# Altium schematic sheet FULL_CB_Power_REV_C.SchDoc
size A4; DrawnBy: Philip Rowse
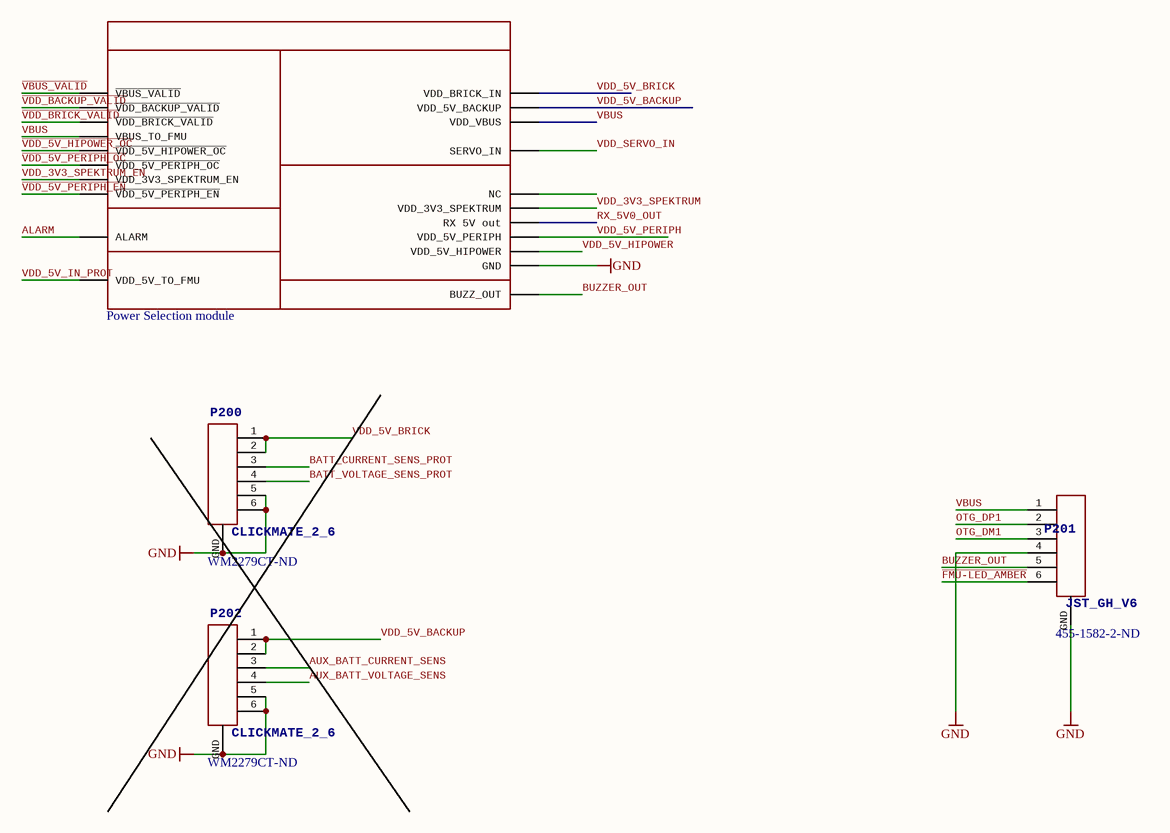
[diagram p0: FULL_CB_Power_REV_C.SchDoc]

## Parts
P200  CLICKMATE_2_6  Supplier Part Number 1: WM2279CT-ND  [CLICKMATE_V6_2MM]
P201  JST_GH_V6  Supplier Part Number 1: 455-1582-2-ND  [JST_GH_V6]
P202  CLICKMATE_2_6  Supplier Part Number 1: WM2279CT-ND  [CLICKMATE_V6_2MM]
PSM200  Power Selection module  [PSM]

## Nets
GND: P200.5 P200.6 P200.GND P201.4 P201.GND P202.5 P202.6 P202.GND PSM200.GND
ALARM: PSM200.ALARM
AUX_BATT_CURRENT_SENS: P202.3
AUX_BATT_VOLTAGE_SENS: P202.4
BATT_CURRENT_SENS_PROT: P200.3
BATT_VOLTAGE_SENS_PROT: P200.4
BUZZER_OUT: P201.5 PSM200.BUZZER_OUT(BUZZ_OUT)
~{FMU-LED_AMBER}: P201.6
OTG_DM1: P201.3
OTG_DP1: P201.2
RX_5V0_OUT: PSM200.RX(RX_5V_out)
~{VBUS_VALID}: PSM200.!VBUS_VALID(~{VBUS_VALID})
~{VDD_5V_HIPOWER_OC}: PSM200.!VDD_5V_HIPOWER_OC(~{VDD_5V_HIPOWER_OC})
~{VDD_5V_PERIPH_EN}: PSM200.!VDD_5V_PERIPH_EN(~{VDD_5V_PERIPH_EN})
~{VDD_5V_PERIPH_OC}: PSM200.!VDD_5V_PERIPH_OC(~{VDD_5V_PERIPH_OC})
~{VDD_BACKUP_VALID}: PSM200.!VDD_BACKUP_VALID(~{VDD_BACKUP_VALID})
~{VDD_BRICK_VALID}: PSM200.!VDD_BRICK_VALID(~{VDD_BRICK_VALID})
VBUS: P201.1 PSM200.VBUS(VBUS_TO_FMU) PSM200.VDD_VBUS
VDD_3V3_SPEKTRUM: PSM200.SPEK(VDD_3V3_SPEKTRUM)
VDD_3V3_SPEKTRUM_EN: PSM200.VDD_3V3_SPEKTRUM_EN
VDD_5V_BACKUP: P202.1 P202.2 PSM200.VDD_5V_BACKUP
VDD_5V_BRICK: P200.1 P200.2 PSM200.VDD_BRICK_IN
VDD_5V_HIPOWER: PSM200.5V_HIPOWER(VDD_5V_HIPOWER)
VDD_5V_IN_PROT: PSM200.VDD_5V_IN_PROT(VDD_5V_TO_FMU)
VDD_5V_PERIPH: PSM200.5V_PERIPH(VDD_5V_PERIPH)
VDD_SERVO_IN: PSM200.SERVO_IN

Not connected (* = marked no-connect by the designer): PSM200 NC

## Notes on the sheet
- Title:
- Date:
- Time:
- https://creativecommons.org/publicdomain/zero/1.0/
- Sheet:
- Approved:
- of:
- Drawn By:
- Checked By:
- ProfiCNC

## Library data of the parts
P200 P202 = CLICKMATE_2_6: Connector, Header, 6Pos, 2.54MM, Vert, THT, Au; Supplier 1: Digi-Key
P201 = JST_GH_V6: BM06B-GHS-TBT; Supplier 1: Digi-Key
PSM200 = PSMPSM: PCA, PSM, Assembly